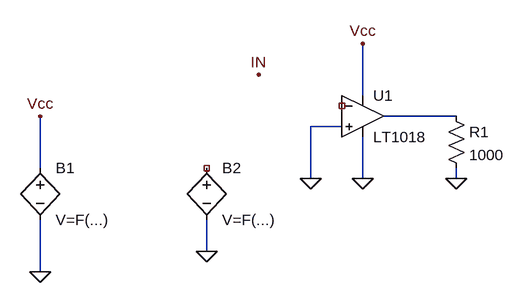
[diagram p0: schematic chrono.asc]
chrono.asc, the LTspice schematic file:
Version 4
SHEET 1 880 680
WIRE 624 -64 624 -144
WIRE 768 -32 656 -32
WIRE 592 -16 544 -16
WIRE 128 48 128 -32
WIRE 544 64 544 -16
WIRE 624 64 624 0
WIRE 768 64 768 48
WIRE 384 176 384 128
WIRE 128 208 128 128
FLAG 128 208 0
FLAG 128 -32 Vcc
FLAG 384 176 0
FLAG 624 64 0
FLAG 544 64 0
FLAG 624 -144 Vcc
FLAG 464 -96 IN
FLAG 768 64 0
SYMBOL bv 128 32 R0
SYMATTR InstName B1
SYMBOL bv 384 32 R0
SYMATTR InstName B2
SYMBOL Comparators\\LT1018 624 -32 R0
SYMATTR InstName U1
SYMBOL res 752 -48 R0
SYMATTR InstName R1
SYMATTR Value 1000

The netlist it stands for:
* chrono.asc
B1 Vcc 0 V=F(...)
B2 NC_01 0 V=F(...)
XU1 0 NC_02 Vcc 0 N001 LT1018  ; pins In+ In- V+ V- OUT
R1 N001 0 1000
.lib LTC1.lib
.backanno
.end